# Altium schematic sheet Pendulum_Project.SchDoc
size A
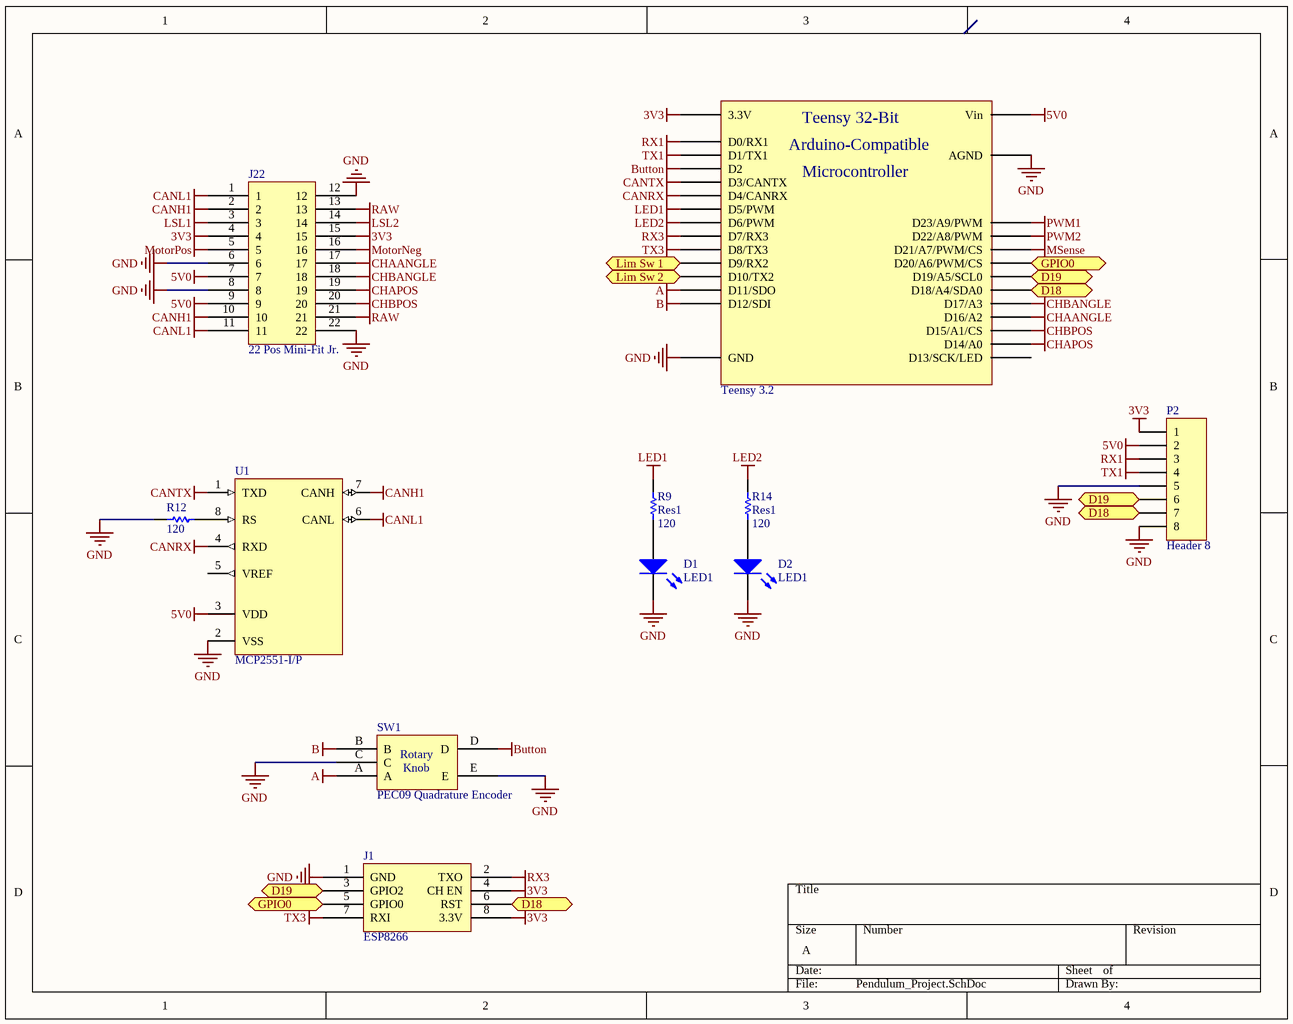
[diagram p0: Pendulum_Project.SchDoc]

## Parts
D1  LED1  [5mm Rad LED]
D2  LED1  [5mm Rad LED]
J1  ESP8266  [ESP8266]
J22  22 Pos Mini-Fit Jr.  [22 pos Mini-Fit Jr. R/A Header]
P2  Header 8  [HDR1X8]
R9  Res1  value 120  [AXIAL-0.3]
R12  120  [AXIAL-0.3]
R14  Res1  value 120  [AXIAL-0.3]
SW1  PEC09 Quadrature Encoder  [PEC09 Series Encoder]
Teensy_3.2  Teensy 3.2 Outside  [Teensy 3.2 Outside Only]  (value not drawn)
U1  MCP2551-I/P  [PDIP300-P8]

## Ports
D18, D19, GPIO0, Lim Sw 1, Lim Sw 2

## Nets
3V3: J1.4(CH_EN) J1.8(3.3V) J22.4 J22.15 P2.1 Teensy_3.2.31(3.3V)
5V0: J22.7 J22.9 P2.2 Teensy_3.2.33(Vin) U1.3(VDD)
A: SW1.A Teensy_3.2.2(D11/SDO)
B: SW1.B Teensy_3.2.1(D12/SDI)
Button: SW1.D Teensy_3.2.11(D2)
CANH1: J22.2 J22.10 U1.7(CANH)
CANL1: J22.1 J22.11 U1.6(CANL)
CANRX: Teensy_3.2.9(D4/CANRX) U1.4(RXD)
CANTX: Teensy_3.2.10(D3/CANTX) U1.1(TXD)
CHAANGLE: J22.17 Teensy_3.2.23(D16/A2)
CHAPOS: J22.19 Teensy_3.2.21(D14/A0)
CHBANGLE: J22.18 Teensy_3.2.24(D17/A3)
CHBPOS: J22.20 Teensy_3.2.22(D15/A1/CS)
GND: D1.2(K) D2.2(K) J1.1(GND) J22.6 J22.8 J22.12 J22.22 P2.5 P2.8 R12.2 SW1.C SW1.E Teensy_3.2.14(GND) Teensy_3.2.32(AGND) U1.2(VSS)
LED1: R9.2 Teensy_3.2.8(D5/PWM)
LED2: R14.2 Teensy_3.2.7(D6/PWM)
LSL1: J22.3
LSL2: J22.14
MotorNeg: J22.16
MotorPos: J22.5
MSense: Teensy_3.2.28(D21/A7/PWM/CS)
PWM1: Teensy_3.2.30(D23/A9/PWM)
PWM2: Teensy_3.2.29(D22/A8/PWM)
RAW: J22.13 J22.21
RX1: P2.3 Teensy_3.2.13(D0/RX1)
RX3: J1.2(TXO) Teensy_3.2.6(D7/RX3)
TX1: P2.4 Teensy_3.2.12(D1/TX1)
TX3: J1.7(RXI) Teensy_3.2.5(D8/TX3)
D18: J1.6(RST) P2.7 Teensy_3.2.25(D18/A4/SDA0) ; port D18
D19: J1.3(GPIO2) P2.6 Teensy_3.2.26(D19/A5/SCL0) ; port D19
GPIO0: J1.5(GPIO0) Teensy_3.2.27(D20/A6/PWM/CS) ; port GPIO0
Lim Sw 1: Teensy_3.2.4(D9/RX2) ; port Lim Sw 1
Lim Sw 2: Teensy_3.2.3(D10/TX2) ; port Lim Sw 2
NetD1_1: D1.1(A) R9.1
NetD2_1: D2.1(A) R14.1
NetR12_1: R12.1 U1.8(RS)

Not connected (* = marked no-connect by the designer): Teensy_3.2 20(D13/SCK/LED); U1 5(VREF)

## Notes on the sheet
- (in symbol Quadrature PEC09) Rotary; Knob
- (in symbol Teensy 3.2 Outside) Teensy 32-Bit; Arduino-Compatible; Microcontroller

## Library data of the parts
D1 D2 = LED1: Typical RED GaAs LED; Published: 8-Jun-2000; LatestRevisionDate: 08-Jul-2005; LatestRevisionNote: Mech Layer 1 removed.; PackageReference: LED-1; Publisher: Altium Limited; PackageDescription: LED; 2 Leads
J1 = ESP8266: Sparkfun ESP8266 Module (WRL-13678); Supplier 1: Sparkfun; Supplier Part Number 1: WRL-13678
J22 = 22 Pos Header: Manufacturer: Molex; Supplier 1: Digi-Key; Supplier 2: Mouser; PartNumber: 39-30-1220; Supplier Part Number 2: 538-39-30-1220
P2 = Header 8: Header, 8-Pin; LatestRevisionDate: 17-Jul-2002; LatestRevisionNote: Re-released for DXP Platform.; Publisher: Altium Limited
R9 R14 = Res1: Resistor; Published: 8-Jun-2000; LatestRevisionDate: 17-Jul-2002; LatestRevisionNote: Re-released for DXP Platform.; PackageReference: AXIAL-0.3; Publisher: Altium Limited; PackageDescription: Axial Device, Thru-Hole; 2 Leads; 0.3 in Pin Spacing
R12 = Res1: Resistor; Value: 1K; Published: 8-Jun-2000; LatestRevisionDate: 17-Jul-2002; LatestRevisionNote: Re-released for DXP Platform.; PackageReference: AXIAL-0.3; Publisher: Altium Limited; PackageDescription: Axial Device, Thru-Hole; 2 Leads; 0.3 in Pin Spacing
SW1 = Quadrature PEC09: ENCODER INCREMENTAL W/SWITCH 9MM; Manufacturer: Bourns Inc.; PartNumber: PEC09-2220F-S0012; Supplier 1: Digi-Key; Supplier Part Number 1: PEC09-2220F-S0012-ND
Teensy_3.2 = Teensy 3.2 Outside: 32 Bit Arduino-Compatible Microcontroller; Manufacturer: PRJC; PartNumber: Teensy 3.2; Supplier 1: Sparkfun; Supplier Part Number 1: DEV-13736
U1 = MCP2551-I/P: High-Speed CAN Transceiver, 8-Pin PDIP, Industrial Temperature; Manufacturer: Microchip; DatasheetVersion: revF, Jul-2010; PackageVersion: revBB, Aug-2009; PackageReference: PDIP300-P8; PackageDescription: 8-Lead Plastic Dual In-Line (P) - 300 mil Body [PDIP]; Supplier 1: Digi-Key; Supplier Part Number 1: MCP2551-I/P-ND; Supplier 2: Farnell; Supplier Part Number 2: 1292240; Supplier 3: Newark; Supplier Part Number 3: 61K2947; Supplier 4: Mouser; Supplier Part Number 4: 579-MCP2551-I/P; Mounting Technology: Through Hole; Code_JEDEC: MS-001; PartNumber: MCP2551-I/P; ComponentLink1Description: Manufacturer URL; ComponentLink1URL: http://www.microchip.com/; ComponentLink2Description: Datasheet; ComponentLink2URL: http://ww1.microchip.com/downloads/en/DeviceDoc/21667F.pdf; ComponentLink3Description: Package Specification; ComponentLink3URL: http://www.microchip.com/stellent/groups/techpub_sg/documents/packagingspec/en012702.pdf